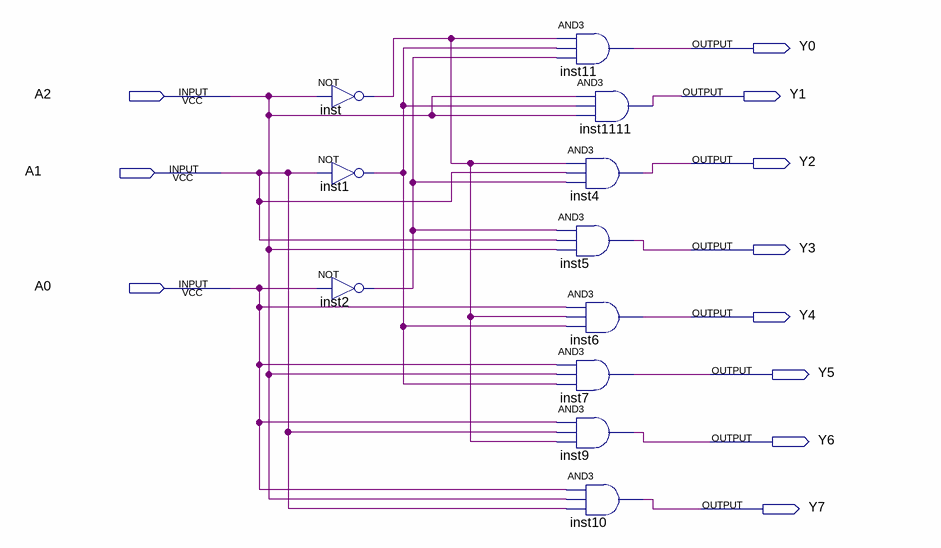
[diagram p0: schematic sheet]
// Quartus schematic decoder_3to8.bdf as structural Verilog: 11 symbols, 11 pins
module decoder_3to8 (
  input  A2,
  input  A1,
  input  A0,
  output Y0,
  output Y1,
  output Y2,
  output Y3,
  output Y4,
  output Y5,
  output Y6,
  output Y7
);

  wire inst1_out, inst2_out, inst_out;

  not inst (inst_out, A2);
  not inst1 (inst1_out, A1);
  not inst2 (inst2_out, A0);
  and inst11 (Y0, inst_out, inst1_out, inst2_out);
  and inst1111 (Y1, A2, inst1_out, A2);
  and inst4 (Y2, inst_out, A1, inst2_out);
  and inst5 (Y3, inst2_out, A1, A2);
  and inst6 (Y4, A0, inst_out, inst1_out);
  and inst7 (Y5, A0, A2, inst1_out);
  and inst9 (Y6, A0, A1, inst_out);
  and inst10 (Y7, A0, A2, A1);
endmodule
